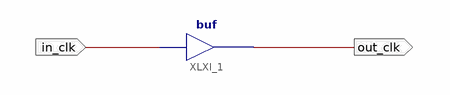
[diagram p0: schematic sheet 1]
// Xilinx ISE schematic freq_pass_through.sch (aspartan6) as structural Verilog: 1 symbols, 2 ports
module freq_pass_through (
  input  in_clk,
  output out_clk
);

  buf XLXI_1 (out_clk, in_clk);
endmodule
